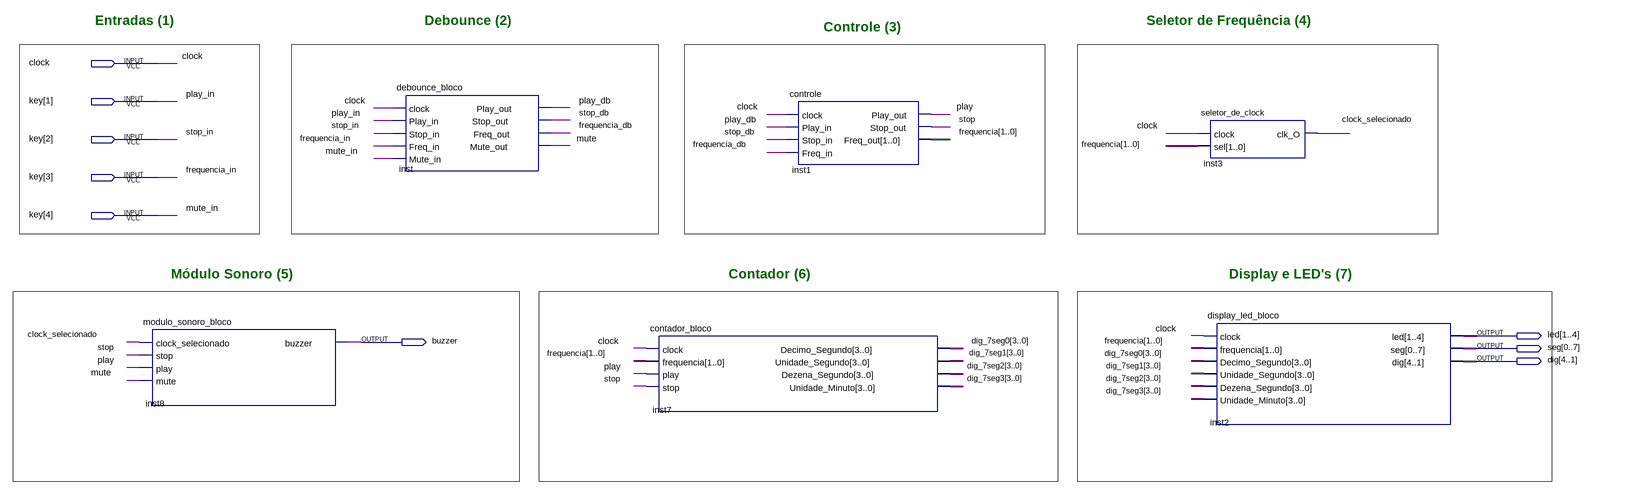
[diagram p0: schematic sheet]
// Quartus schematic Buzzer_Star_Wars.bdf as structural Verilog: 6 symbols, 9 pins
module Buzzer_Star_Wars (
  input  clock,
  input  [4:1] key,
  output [1:4] led,
  output buzzer,
  output [0:7] seg,
  output [4:1] dig
);

  wire clock_selecionado, frequencia_db, mute, play, play_db, stop, stop_db;
  wire [1:0] frequencia;
  wire [3:0] dig_7seg0, dig_7seg1, dig_7seg2, dig_7seg3;

  modulo_sonoro_bloco inst8 (
    .clock_selecionado(clock_selecionado), .stop(stop), .play(play), .mute(mute), .buzzer(buzzer));
  debounce_bloco inst (
    .clock(clock), .Play_in(key[1]), .Stop_in(key[2]), .Freq_in(key[3]), .Mute_in(key[4]),
    .Play_out(play_db), .Stop_out(stop_db), .Freq_out(frequencia_db), .Mute_out(mute));
  contador_bloco inst7 (
    .clock(clock), .frequencia(frequencia), .play(play), .stop(stop), .Decimo_Segundo(dig_7seg0),
    .Unidade_Segundo(dig_7seg1), .Dezena_Segundo(dig_7seg2), .Unidade_Minuto(dig_7seg3));
  controle inst1 (
    .clock(clock), .Play_in(play_db), .Stop_in(stop_db), .Freq_in(frequencia_db), .Play_out(play),
    .Stop_out(stop), .Freq_out(frequencia));
  seletor_de_clock inst3 (.clock(clock), .sel(frequencia), .clk_O(clock_selecionado));
  display_led_bloco inst2 (
    .clock(clock), .frequencia(frequencia), .Decimo_Segundo(dig_7seg0), .Unidade_Segundo(dig_7seg1),
    .Dezena_Segundo(dig_7seg2), .Unidade_Minuto(dig_7seg3), .led(led), .seg(seg), .dig(dig));

  // Other names for the same wires on the sheet: frequencia_in = key[3]; mute_in = key[4]; play_in = key[1];
  //   stop_in = key[2]

  // Notes on the sheet:
  //   Entradas (1)
  //   Debounce (2)
  //   Seletor de Frequência (4)
  //   Controle (3)
  //   Módulo Sonoro (5)
  //   Contador (6)
  //   Display e LED's (7)
endmodule
